# Altium schematic sheet SG_Feedback.SchDoc
size A
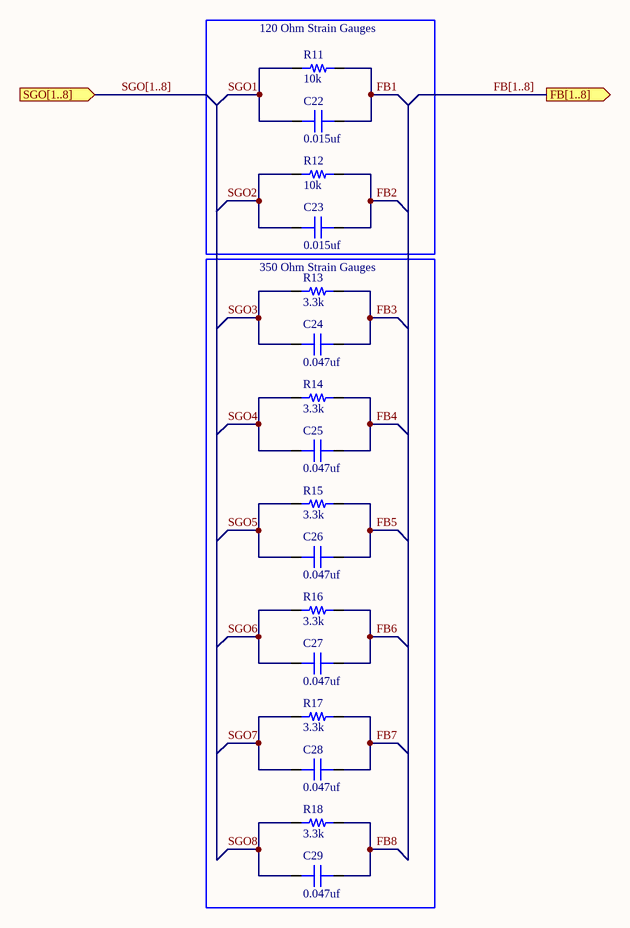
[diagram p0: SG_Feedback.SchDoc]

## Parts
C22  value 0.015uf  [CAP 0603/1608]  (hidden comment: Capacitor MLCC 0.015uf 25V CAP 0603/1608)
C23  value 0.015uf  [CAP 0603/1608]  (hidden comment: Capacitor MLCC 0.015uf 25V CAP 0603/1608)
C24  value 0.047uf  [CAP 0603/1608]  (hidden comment: Capacitor MLCC 0.047uf 50V CAP 0603/1608)
C25  value 0.047uf  [CAP 0603/1608]  (hidden comment: Capacitor MLCC 0.047uf 50V CAP 0603/1608)
C26  value 0.047uf  [CAP 0603/1608]  (hidden comment: Capacitor MLCC 0.047uf 50V CAP 0603/1608)
C27  value 0.047uf  [CAP 0603/1608]  (hidden comment: Capacitor MLCC 0.047uf 50V CAP 0603/1608)
C28  value 0.047uf  [CAP 0603/1608]  (hidden comment: Capacitor MLCC 0.047uf 50V CAP 0603/1608)
C29  value 0.047uf  [CAP 0603/1608]  (hidden comment: Capacitor MLCC 0.047uf 50V CAP 0603/1608)
R11  value 10k  [RES 0603/1608]  (hidden comment: Resistor 10k 0603 1/10W 1%)
R12  value 10k  [RES 0603/1608]  (hidden comment: Resistor 10k 0603 1/10W 1%)
R13  value 3.3k  [RES 0603/1608]  (hidden comment: Resistor 3.3k 0603 1/10W 5%)
R14  value 3.3k  [RES 0603/1608]  (hidden comment: Resistor 3.3k 0603 1/10W 5%)
R15  value 3.3k  [RES 0603/1608]  (hidden comment: Resistor 3.3k 0603 1/10W 5%)
R16  value 3.3k  [RES 0603/1608]  (hidden comment: Resistor 3.3k 0603 1/10W 5%)
R17  value 3.3k  [RES 0603/1608]  (hidden comment: Resistor 3.3k 0603 1/10W 5%)
R18  value 3.3k  [RES 0603/1608]  (hidden comment: Resistor 3.3k 0603 1/10W 5%)

## Blocks framed on the sheet
120 Ohm Strain Gauges: C22 C23 R11 R12
350 Ohm Strain Gauges: C24-C29 R13-R18

## Ports
FB[1..8] (out), SGO[1..8] (in)

## Nets
FB1: C22.2 R11.2
FB2: C23.2 R12.2
FB3: C24.2 R13.2
FB4: C25.2 R14.2
FB5: C26.2 R15.2
FB6: C27.2 R16.2
FB7: C28.2 R17.2
FB8: C29.2 R18.2
SGO1: C22.1 R11.1
SGO2: C23.1 R12.1
SGO3: C24.1 R13.1
SGO4: C25.1 R14.1
SGO5: C26.1 R15.1
SGO6: C27.1 R16.1
SGO7: C28.1 R17.1
SGO8: C29.1 R18.1

## Buses and harness runs
bus FB[1..8] = port FB[1..8]
bus SGO[1..8] = port SGO[1..8]

## Library data of the parts
C22 C23 = 578: Manufacturer_id: 1; idCapacitor: 578; Name: Cap_0.015uf_25V_CAP 0603/1608; Dielectric: Ceramic; Created_By: Nick Mah; Drawer_id: 1; Voltage_Rating: 25V; Package: CAP 0603/1608; Created_Date: 10/20/2018
C24-C29 = 941: Manufacturer_id: 1; idCapacitor: 941; Name: Cap_0.047uf_50V_CAP 0603/1608; Dielectric: Ceramic; Created_By: Nick Mah; Drawer_id: 1; Voltage_Rating: 50V; Package: CAP 0603/1608; Created_Date: 10/20/2018
R11 R12 = 313: Manufacturer_id: 1; idResistor: 313; Name: Res_10k_0603_1/10W_1%; Created_By: Nick Mah; Supplier 1: Digi-Key; Drawer_id: 1; Tolerance: 1%; Power: 1/10W; Package: 0603; ComponentLink1Description: Datasheet; Created_Date: 2018-10-20
R13-R18 = 1381: Manufacturer_id: 1; idResistor: 1381; Name: Res_3.3k_0603_1/10W_5%; Created_By: Nick Mah; Supplier 1: Digi-Key; Drawer_id: 1; Tolerance: 5%; Power: 1/10W; Package: 0603; ComponentLink1Description: Datasheet; Created_Date: 2018-10-20